# Altium project Ejemplo_ViasEspeciales.PrjPcb
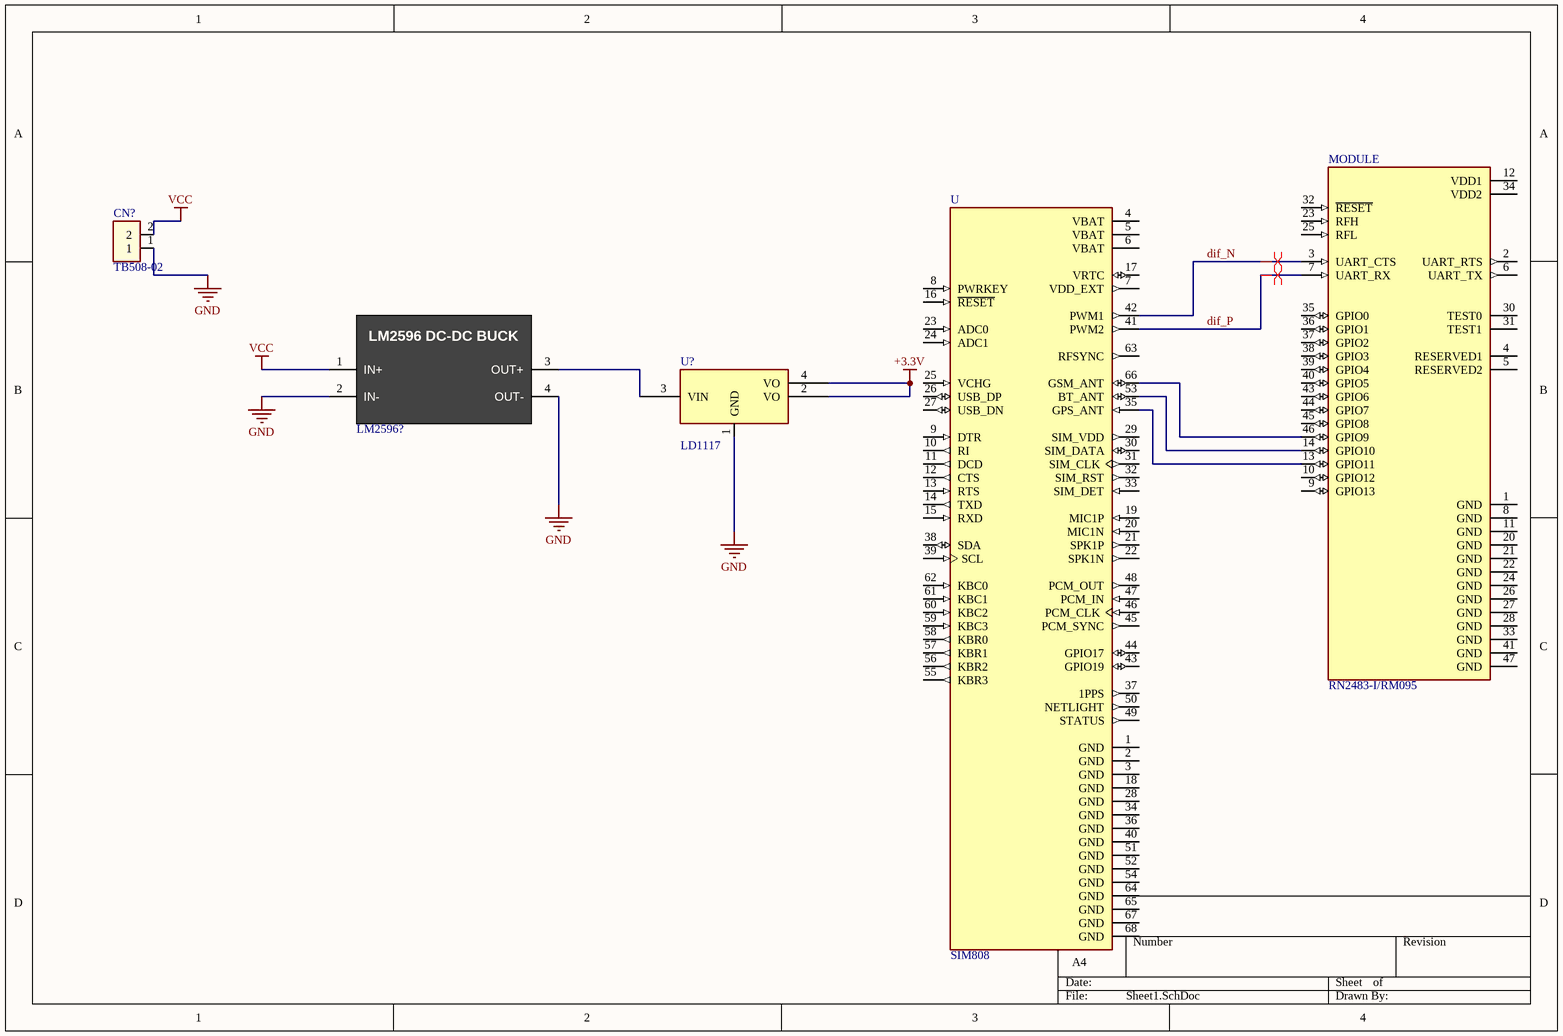
[diagram p0: Sheet1.SchDoc]
1 sheet, 5 parts. Net scope: global (net labels, ports and power ports of the same name join across sheets).
Board file: PCB1.PcbDoc

## Sheet Sheet1.SchDoc
size A4; SheetNumber: 1; SheetTotal: 1

### Parts
CN?  TB508-02  [TB508-02]
LM2596?  LM2596?  [LM2596 - 3D]  (value not drawn)
MODULE  RN2483-I/RM095  [MICROCHIP_RN2483-I/RM095]
U  SIM808  [XCVR_SIM808]
U?  LD1117  [SOT223_4]

### Nets
+3.3V: U?.2(VO) U?.4(VO)
GND: CN?.1 LM2596?.2(IN-) LM2596?.4(OUT-) U?.1(GND)
VCC: CN?.2 LM2596?.1(IN+)
dif_N: MODULE.3(UART_CTS) U.42(PWM1)
dif_P: MODULE.7(UART_RX) U.41(PWM2)
NetLM2596?_3: LM2596?.3(OUT+) U?.3(VIN)
NetMODULE_13: MODULE.13(GPIO11) U.35(GPS_ANT)
NetMODULE_14: MODULE.14(GPIO10) U.53(BT_ANT)
NetMODULE_46: MODULE.46(GPIO9) U.66(GSM_ANT)

Not connected (* = marked no-connect by the designer): MODULE 1(GND) 2(UART_RTS) 4(RESERVED1) 5(RESERVED2) 6(UART_TX) 8(GND) 9(GPIO13) 10(GPIO12) 11(GND) 12(VDD1) 20(GND) 21(GND) 22(GND) 23(RFH) 24(GND) 25(RFL) 26(GND) 27(GND) 28(GND) 30(TEST0) 31(TEST1) 32(~{RESET}) 33(GND) 34(VDD2) 35(GPIO0) 36(GPIO1) 37(GPIO2) 38(GPIO3) 39(GPIO4) 40(GPIO5) 41(GND) 43(GPIO6) 44(GPIO7) 45(GPIO8) 47(GND); U 1(GND) 2(GND) 3(GND) 4(VBAT) 5(VBAT) 6(VBAT) 7(VDD_EXT) 8(PWRKEY) 9(DTR) 10(RI) 11(DCD) 12(CTS) 13(RTS) 14(TXD) 15(RXD) 16(~{RESET}) 17(VRTC) 18(GND) 19(MIC1P) 20(MIC1N) 21(SPK1P) 22(SPK1N) 23(ADC0) 24(ADC1) 25(VCHG) 26(USB_DP) 27(USB_DN) 28(GND) 29(SIM_VDD) 30(SIM_DATA) 31(SIM_CLK) 32(SIM_RST) 33(SIM_DET) 34(GND) 36(GND) 37(1PPS) 38(SDA) 39(SCL) 40(GND) 43(GPIO19) 44(GPIO17) 45(PCM_SYNC) 46(PCM_CLK) 47(PCM_IN) 48(PCM_OUT) 49(STATUS) 50(NETLIGHT) 51(GND) 52(GND) 54(GND) 55(KBR3) 56(KBR2) 57(KBR1) 58(KBR0) 59(KBC3) 60(KBC2) 61(KBC1) 62(KBC0) 63(RFSYNC) 64(GND) 65(GND) 67(GND) 68(GND)

### Layout directives
differential pair: dif_N, dif_P

### Notes on the sheet
- (in symbol LM2596?) LM2596 DC-DC BUCK

### Library data of the parts
CN? = TB-02: Terminal Block; Manufacturer: *; Part number: *; Unit price: *; Value: TB508-02
LM2596? = LM2596?: Módulo de DC-DC LM2596, regulador de convertidor Buck de reducción ajustable, VIN: 3,2 V-40V ; VOUT: 1,25 V-35V
MODULE = RN2483-I/RM095: Sub-GHz Dual Band Long Range Transceiver LoRa Module; MF: Microchip; Package: None; MP: RN2483-I/RM095; Value: *; Availability: Unavailable; SnapEDA_Link: https://www.snapeda.com/parts/RN2483-I/RM095/Microchip/view-part/378307/?ref=snap; Price: None
U = SIM808: SIM808 GPS, GPRS/GSM RF Arduino Platform Evaluation Expansion Board; MF: Adafruit Industries; MP: SIM808; Package: None; SnapEDA_Link: https://www.snapeda.com/parts/SIM808/SIMcom%20Wireless%20solutions%20Co.%2CLtd/view-part/424834/?ref=snap; Availability: Unavailable; Price: None; Value: *
U? = VREG_1117_SOT223: REG, Linear, LDO1V, 0.8A, SOT-223; MANF_P#: LD1117, LM1117, AMS1117, TLV1117, REG1117, NCP1117, LT1117, SPX1117; MANF: TI, ON, ST; PARAM2: 1.2/1.5/1.8/2.5/2.85/3.3/5V; PARAM: LDO1V, 0.8A; VALUE: LD1117